# Altium schematic sheet WCH_hairDrierCore_V1.5.SchDoc
size C; SheetNumber: 2; SheetTotal: 2
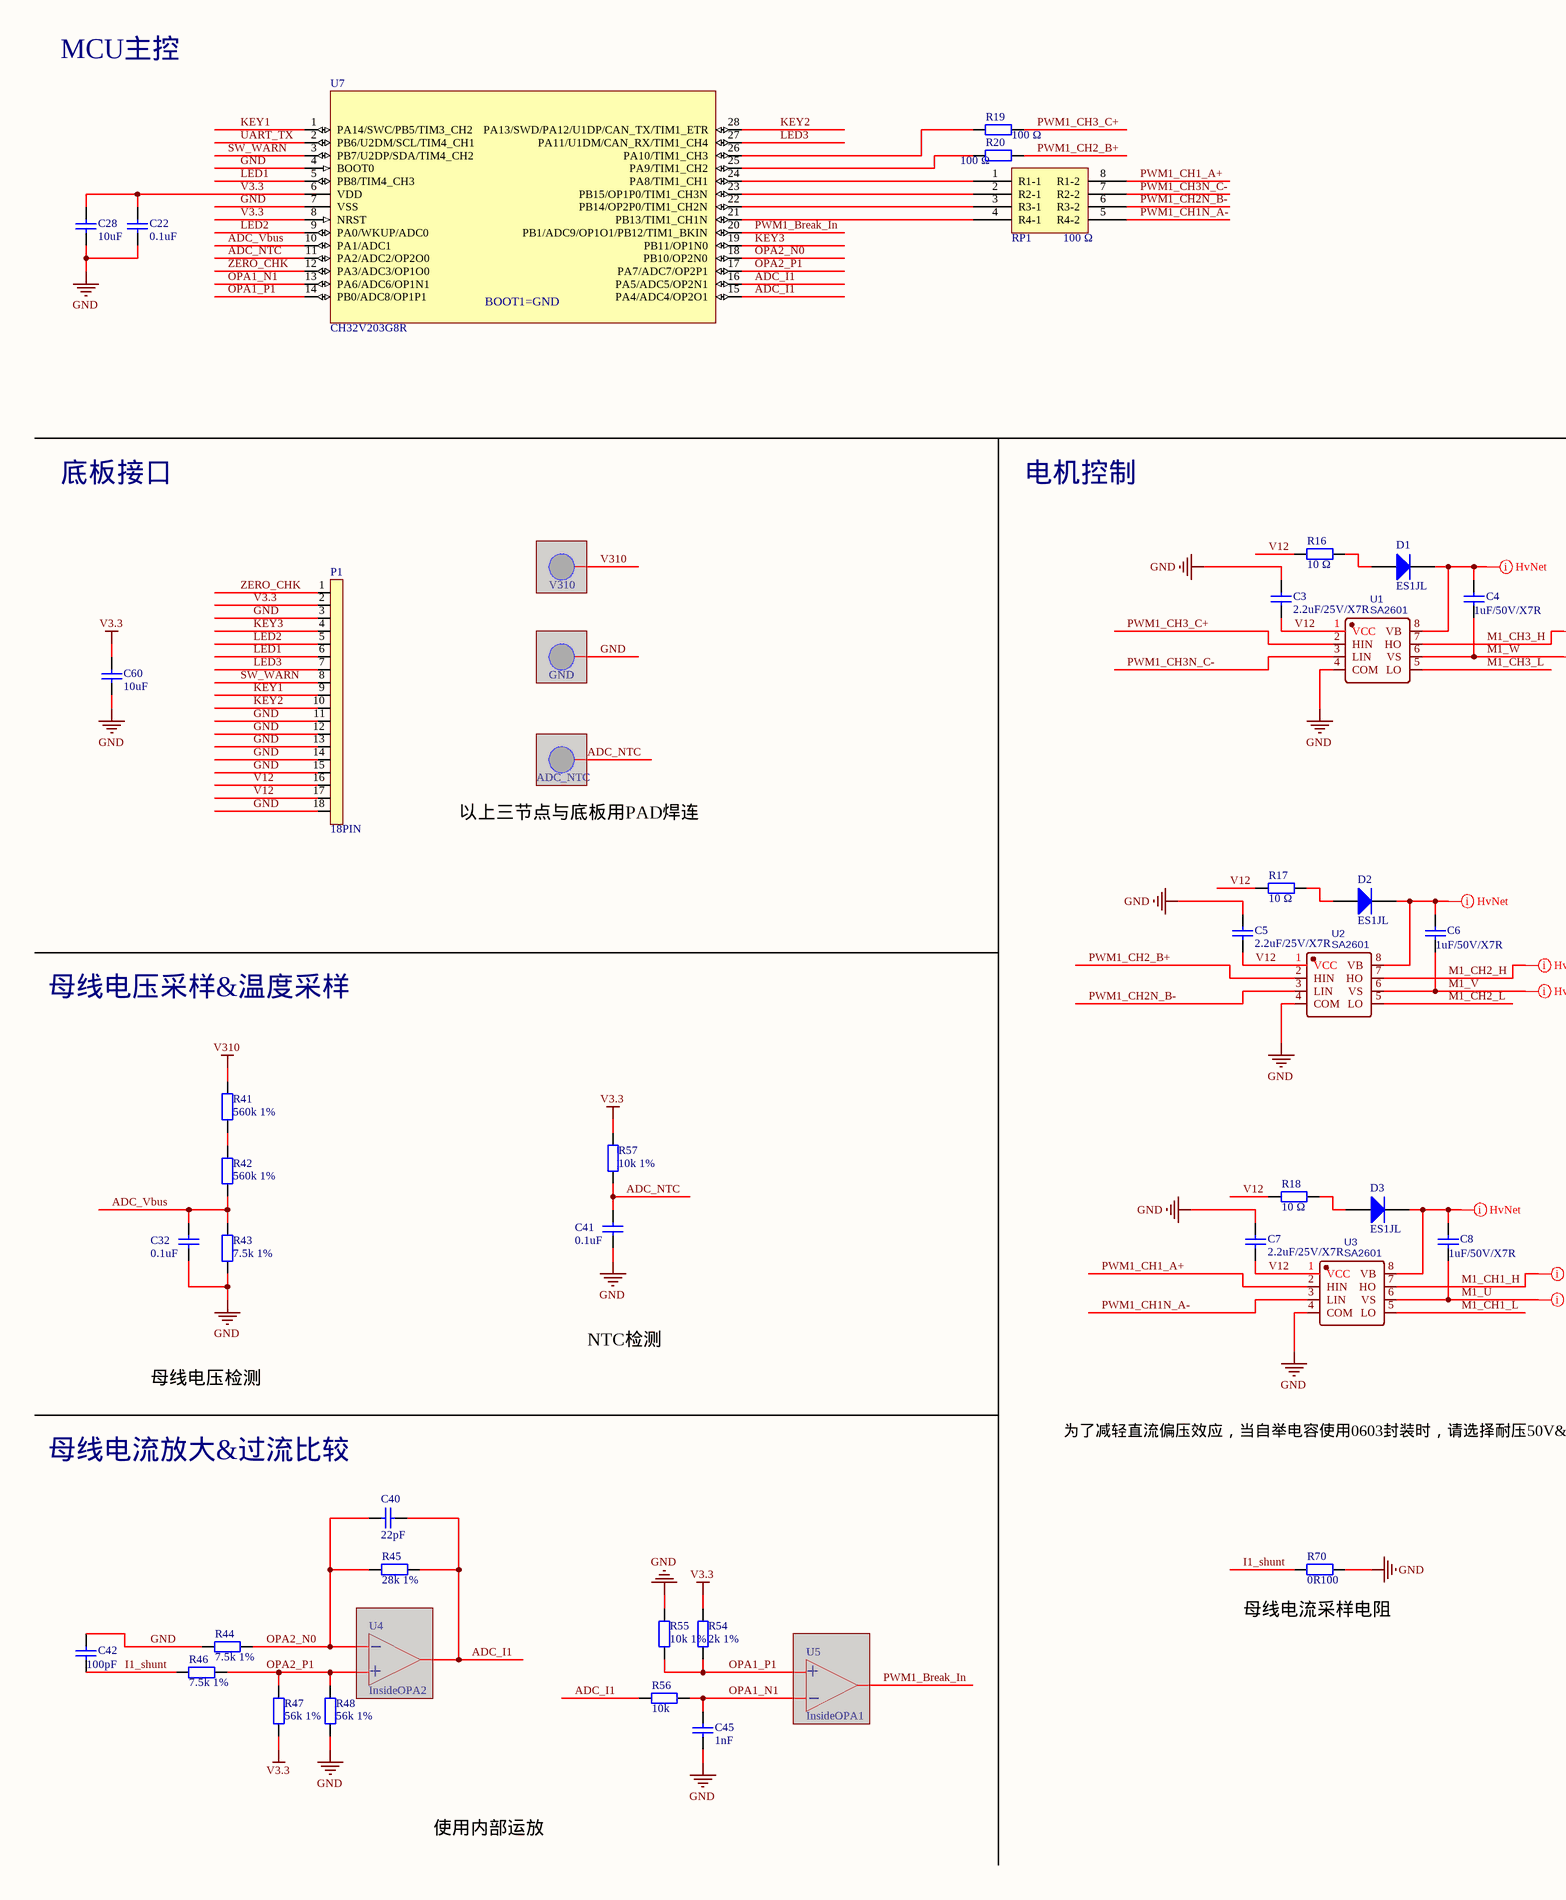
[diagram p0: WCH_hairDrierCore_V1.5.SchDoc, left]
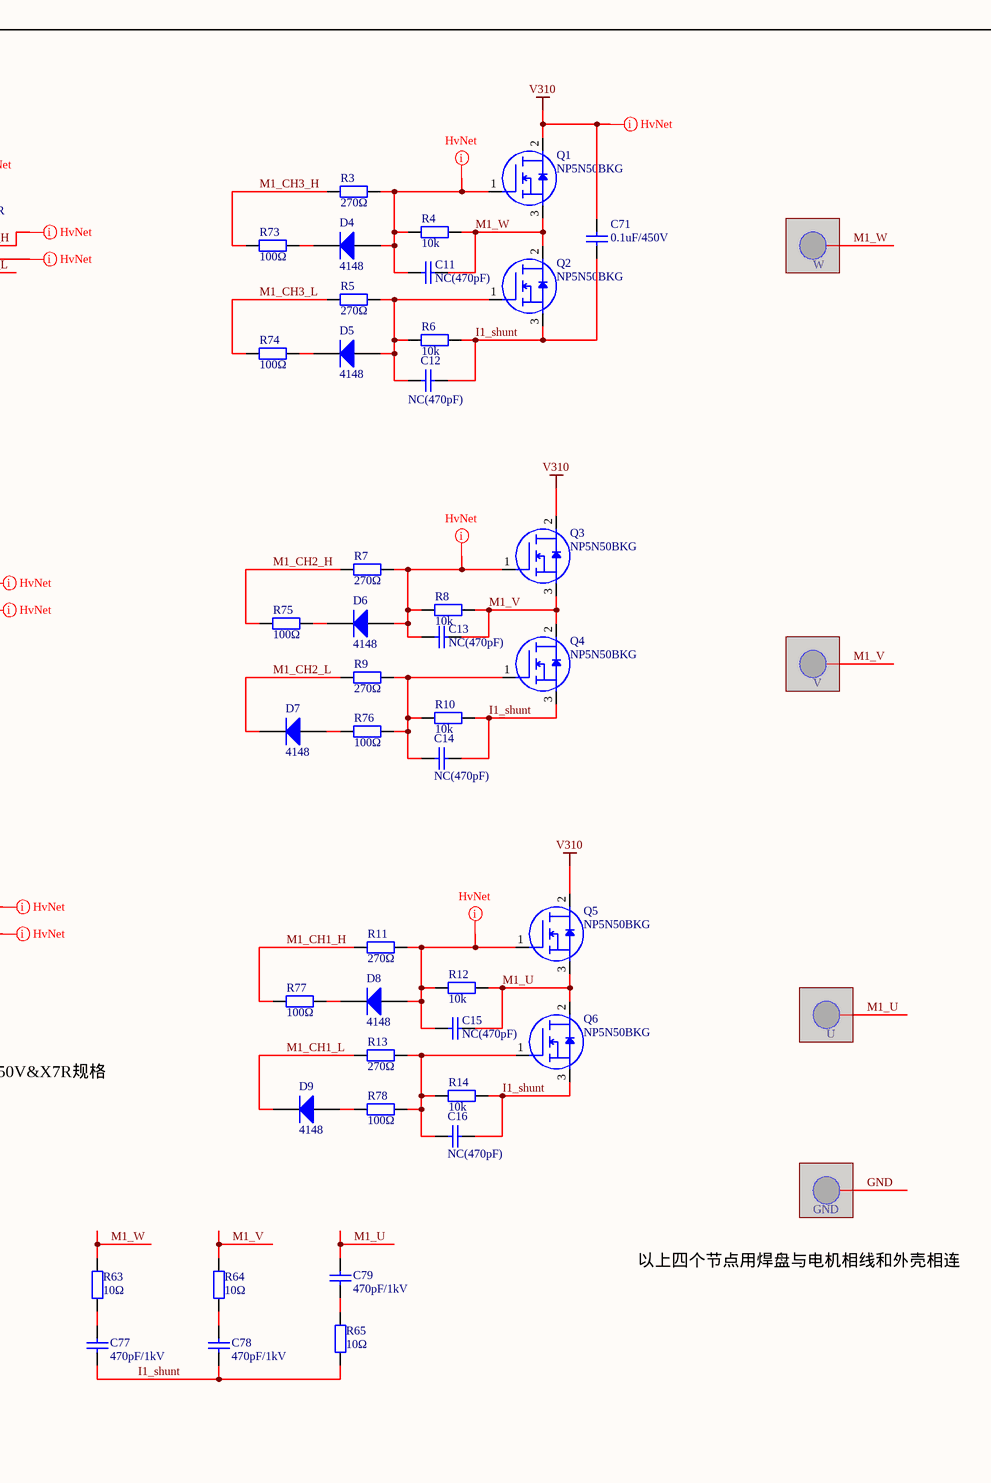
[diagram p1: WCH_hairDrierCore_V1.5.SchDoc, right]

## Parts
(Parts that share a designator on the sheet are numbered #1, #2 ... from top to bottom, then left to right.)
?#1  V310  (masked out: inside a compile mask, not in the netlist)
?#2  W  (masked out: inside a compile mask, not in the netlist)
?#3  GND  (masked out: inside a compile mask, not in the netlist)
?#4  ADC_NTC  (masked out: inside a compile mask, not in the netlist)
?#5  V  (masked out: inside a compile mask, not in the netlist)
?#6  U  (masked out: inside a compile mask, not in the netlist)
?#7  GND  (masked out: inside a compile mask, not in the netlist)
C3  2.2uF/25V/X7R  [M_C0805]
C4  1uF/50V/X7R  [M_C0805]
C5  2.2uF/25V/X7R  [M_C0805]
C6  1uF/50V/X7R  [M_C0805]
C7  2.2uF/25V/X7R  [M_C0805]
C8  1uF/50V/X7R  [M_C0805]
C11  NC(470pF)  [M_C0402-]
C12  NC(470pF)  [M_C0402-]
C13  NC(470pF)  [M_C0402-]
C14  NC(470pF)  [M_C0402-]
C15  NC(470pF)  [M_C0402-]
C16  NC(470pF)  [M_C0402-]
C22  0.1uF  [C0402S]
C28  10uF  [0603C]
C32  0.1uF  [C0402S]
C40  22pF  [C0402S]
C41  0.1uF  [C0402S]
C42  100pF  [C0402S]
C45  1nF  [C0402S]
C60  10uF  [0603C]
C71  0.1uF/450V  [1206-]
C77  470pF/1kV  [M_C1206-]
C78  470pF/1kV  [M_C1206-]
C79  470pF/1kV  [M_C1206-]
D1  ES1JL  [SOD-123]
D2  ES1JL  [SOD-123]
D3  ES1JL  [SOD-123]
D4  4148  [SOD523]
D5  4148  [SOD523]
D6  4148  [SOD523]
D7  4148  [SOD523]
D8  4148  [SOD523]
D9  4148  [SOD523]
P1  18PIN  [P1.27-18-SMD]
Q1  NP5N50BKG  [D-PAK-1]
Q2  NP5N50BKG  [D-PAK-1]
Q3  NP5N50BKG  [D-PAK-1]
Q4  NP5N50BKG  [D-PAK-1]
Q5  NP5N50BKG  [D-PAK-1]
Q6  NP5N50BKG  [D-PAK-1]
R3  270Ω  [M_R0402-]
R4  10k  [0402S]
R5  270Ω  [M_R0402-]
R6  10k  [0402S]
R7  270Ω  [M_R0402-]
R8  10k  [0402S]
R9  270Ω  [M_R0402-]
R10  10k  [0402S]
R11  270Ω  [M_R0402-]
R12  10k  [0402S]
R13  270Ω  [M_R0402-]
R14  10k  [0402S]
R16  10 Ω  [0603]
R17  10 Ω  [0603]
R18  10 Ω  [0603]
R19  100 Ω  [C0402S]
R20  100 Ω  [C0402S]
R41  560k 1%  [1206-]
R42  560k 1%  [1206-]
R43  7.5k 1%  [0402S]
R44  7.5k 1%  [0402S]
R45  28k 1%  [0402S]
R46  7.5k 1%  [0402S]
R47  56k 1%  [0402S]
R48  56k 1%  [0402S]
R54  2k 1%  [0402S]
R55  10k 1%  [0402S]
R56  10k  [0402S]
R57  10k 1%  [0402S]
R63  10Ω  [M_R0805-]
R64  10Ω  [M_R0805-]
R65  10Ω  [M_R0805-]
R70  0R100  [1210]
R73  100Ω  [M_R0402-]
R74  100Ω  [M_R0402-]
R75  100Ω  [M_R0402-]
R76  100Ω  [M_R0402-]
R77  100Ω  [M_R0402-]
R78  100Ω  [M_R0402-]
RP1  100 Ω  [RP4-0402]
U1  SA2601  [SOP8]
U2  SA2601  [SOP8]
U3  SA2601  [SOP8]
U4  InsideOPA2  (masked out: inside a compile mask, not in the netlist)
U5  InsideOPA1  (masked out: inside a compile mask, not in the netlist)
U7  CH32V203G8R  [QSOP28]

## Nets
GND: C3.2 C5.2 C7.2 C22.2 C28.2 C32.2 C41.2 C42.1 C45.1 C60.2 P1.3 P1.11 P1.12 P1.13 P1.14 P1.15 P1.18 R43.1 R44.1 R48.1 R55.2 R70.1 U1.4(COM) U2.4(COM) U3.4(COM) U7.4(BOOT0) U7.7(VSS)
V3.3: C22.1 C28.1 C60.1 P1.2 R47.1 R54.1 R57.1 U7.6(VDD) U7.8(NRST)
V310: C71.1 Q1.2(D) Q3.2(D) Q5.2(D) R41.2
ADC_I1: C40.1 R45.2 R56.1 U7.15(PA4/ADC4/OP2O1) U7.16(PA5/ADC5/OP2N1)
ADC_NTC: C41.1 R57.2 U7.11(PA2/ADC2/OP2O0)
ADC_Vbus: C32.1 R42.1 R43.2 U7.10(PA1/ADC1)
I1_shunt: C12.2 C14.2 C16.2 C42.2 C71.2 C77.1 C78.1 Q2.3(S) Q4.3(S) Q6.3(S) R6.1 R10.1 R14.1 R46.1 R65.1 R70.2
KEY1: P1.9 U7.1(PA14/SWC/PB5/TIM3_CH2)
KEY2: P1.10 U7.28(PA13/SWD/PA12/U1DP/CAN_TX/TIM1_ETR)
KEY3: P1.4 U7.19(PB11/OP1N0)
LED1: P1.6 U7.5(PB8/TIM4_CH3)
LED2: P1.5 U7.9(PA0/WKUP/ADC0)
LED3: P1.7 U7.27(PA11/U1DM/CAN_RX/TIM1_CH4)
M1_CH1_H: R11.2 R77.2 U3.7(HO)
M1_CH1_L: D9.2(K) R13.2 U3.5(LO)
M1_CH2_H: R7.2 R75.2 U2.7(HO)
M1_CH2_L: D7.2(K) R9.2 U2.5(LO)
M1_CH3_H: R3.2 R73.2 U1.7(HO)
M1_CH3_L: R5.2 R74.2 U1.5(LO)
M1_U: C8.2 C15.2 C79.2 Q5.3(S) Q6.2(D) R12.1 U3.6(VS)
M1_V: C6.2 C13.2 Q3.3(S) Q4.2(D) R8.1 R64.2 U2.6(VS)
M1_W: C4.2 C11.2 Q1.3(S) Q2.2(D) R4.1 R63.2 U1.6(VS)
OPA1_N1: C45.2 R56.2 U7.13(PA6/ADC6/OP1N1)
OPA1_P1: R54.2 R55.1 U7.14(PB0/ADC8/OP1P1)
OPA2_N0: C40.2 R44.2 R45.1 U7.18(PB10/OP2N0)
OPA2_P1: R46.2 R47.2 R48.2 U7.17(PA7/ADC7/OP2P1)
PWM1_Break_In: U7.20(PB1/ADC9/OP1O1/PB12/TIM1_BKIN)
PWM1_CH1_A+: RP1.8(R1-2) U3.2(HIN)
PWM1_CH1N_A-: RP1.5(R4-2) U3.3(LIN)
PWM1_CH2_B+: R20.1 U2.2(HIN)
PWM1_CH2N_B-: RP1.6(R3-2) U2.3(LIN)
PWM1_CH3_C+: R19.1 U1.2(HIN)
PWM1_CH3N_C-: RP1.7(R2-2) U1.3(LIN)
SW_WARN: P1.8 U7.3(PB7/U2DP/SDA/TIM4_CH2)
UART_TX: U7.2(PB6/U2DM/SCL/TIM4_CH1)
V12: C3.1 C5.1 C7.1 P1.16 P1.17 R16.2 R17.2 R18.2 U1.1(VCC) U2.1(VCC) U3.1(VCC)
ZERO_CHK: P1.1 U7.12(PA3/ADC3/OP1O0)
NetC4_1: C4.1 D1.2(K) U1.8(VB)
NetC6_1: C6.1 D2.2(K) U2.8(VB)
NetC8_1: C8.1 D3.2(K) U3.8(VB)
NetC11_1: C11.1 D4.1(A) Q1.1(G) R3.1 R4.2
NetC12_1: C12.1 D5.1(A) Q2.1(G) R5.1 R6.2
NetC13_1: C13.1 D6.1(A) Q3.1(G) R7.1 R8.2
NetC14_1: C14.1 Q4.1(G) R9.1 R10.2 R76.1
NetC15_1: C15.1 D8.1(A) Q5.1(G) R11.1 R12.2
NetC16_1: C16.1 Q6.1(G) R13.1 R14.2 R78.1
NetC77_2: C77.2 R63.1
NetC78_2: C78.2 R64.1
NetC79_1: C79.1 R65.2
NetD1_1: D1.1(A) R16.1
NetD2_1: D2.1(A) R17.1
NetD3_1: D3.1(A) R18.1
NetD4_2: D4.2(K) R73.1
NetD5_2: D5.2(K) R74.1
NetD6_2: D6.2(K) R75.1
NetD7_1: D7.1(A) R76.2
NetD8_2: D8.2(K) R77.1
NetD9_1: D9.1(A) R78.2
NetR19_2: R19.2 U7.26(PA10/TIM1_CH3)
NetR20_2: R20.2 U7.25(PA9/TIM1_CH2)
NetR41_1: R41.1 R42.2
NetRP1_1: RP1.1(R1-1) U7.24(PA8/TIM1_CH1)
NetRP1_2: RP1.2(R2-1) U7.23(PB15/OP1P0/TIM1_CH3N)
NetRP1_3: RP1.3(R3-1) U7.22(PB14/OP2P0/TIM1_CH2N)
NetRP1_4: RP1.4(R4-1) U7.21(PB13/TIM1_CH1N)

## Layout directives
net class HV: M1_CH1_H, M1_CH2_H, M1_CH3_H, M1_U, M1_V, M1_W, NetC4_1, NetC6_1, NetC8_1, NetC11_1, NetC13_1, NetC15_1, V310

## Notes on the sheet
- MCU主控
- 底板接口
- 电机控制
- 以上三节点与底板用PAD焊连
- 母线电压采样&温度采样
- NTC检测
- 母线电压检测
- 母线电流放大&过流比较
- 为了减轻直流偏压效应，当自举电容使用0603封装时，请选择耐压50V&X7R规格
- (near R70) 母线电流采样电阻
- 以上四个节点用焊盘与电机相线和外壳相连
- 使用内部运放
- (in symbol CH32V203G8R) BOOT1=GND
- (in symbol InsideOPA) +
- (in symbol InsideOPA2) +

## Library data of the parts
?#1-?#7 = VirtualPort
C3-C8 C11-C16 C22 C28 C32 C40-C42 C45 C60 C71 C77-C79 = Cap Semi: Capacitor (Semiconductor SIM Model); Published: 8-Jun-2000; LatestRevisionDate: 17-Jul-2002; LatestRevisionNote: Re-released for DXP Platform.; PackageReference: C0805; Publisher: Altium Limited
  C3 C5 C7: Value: 2.2uF/25V/X7R
  C4 C6 C8: Value: 1uF/50V/X7R
  C11-C16: Value: NC(470pF)
  C22 C32 C41: Value: 0.1uF
  C28 C60: Value: 10uF
  C40: Value: 22pF
  C42: Value: 100pF
  C45: Value: 1nF
  C71: Value: 0.1uF/450V
  C77-C79: Value: 470pF/1kV
D1-D9 = Diode 1N4148: High Conductance Fast Diode; Published: 8-Jun-2000; LatestRevisionDate: 17-Jul-2002; LatestRevisionNote: Re-released for DXP Platform.; DatasheetDocument: 1997; PackageReference: DO-35; Publisher: Altium Limited; Code_JEDEC: DO-204-AH; ComponentLink1Description: Manufacturer Link; ComponentLink1URL: http://www.fairchildsemi.com/; ComponentLink2Description: Datasheet; ComponentLink2URL: http://www.fairchildsemi.com/ds/1N%2F1N4148.pdf
Q1-Q6 = MOSFET-N
R3-R14 R16-R20 R41-R48 R54-R57 R63-R65 R70 R73-R78 = Res2: Resistor; Published: 8-Jun-2000; LatestRevisionDate: 17-Jul-2002; LatestRevisionNote: Re-released for DXP Platform.; PackageReference: AXIAL-0.4; Publisher: Altium Limited
  R3 R5 R7 R9 R11 R13: Value: 270Ω
  R4 R6 R8 R10 R12 R14 R56: Value: 10k
  R16-R18: Value: 10 Ω
  R19 R20: Value: 100 Ω
  R41 R42: Value: 560k 1%
  R43 R44 R46: Value: 7.5k 1%
  R45: Value: 28k 1%
  R47 R48: Value: 56k 1%
  R54: Value: 2k 1%
  R55 R57: Value: 10k 1%
  R63-R65: Value: 10Ω
  R70: Value: 0R100
  R73-R78: Value: 100Ω
RP1 = Rp4: Value: 100 Ω
U1-U3 = IR2101SPBF: BOM_Manufacturer: Infineon Technologies; Contributor: LCSC; BOM_Supplier: LCSC; BOM_Supplier Part: C537541; BOM_Manufacturer Part: IR2101SPBF; BOM_JLCPCB Part Class: Extended Part; spicePre: U; spiceSymbolName: IR2101SPBF
U4 = InsideOPA
U5 = InsideOPA2
U7 = CH32V203G8R: RISC-V LMD-MCU, 144MHz, for motor & wireless charging